# Altium schematic sheet Server_CPU_Sub_Power_Supplies.SchDoc
size D
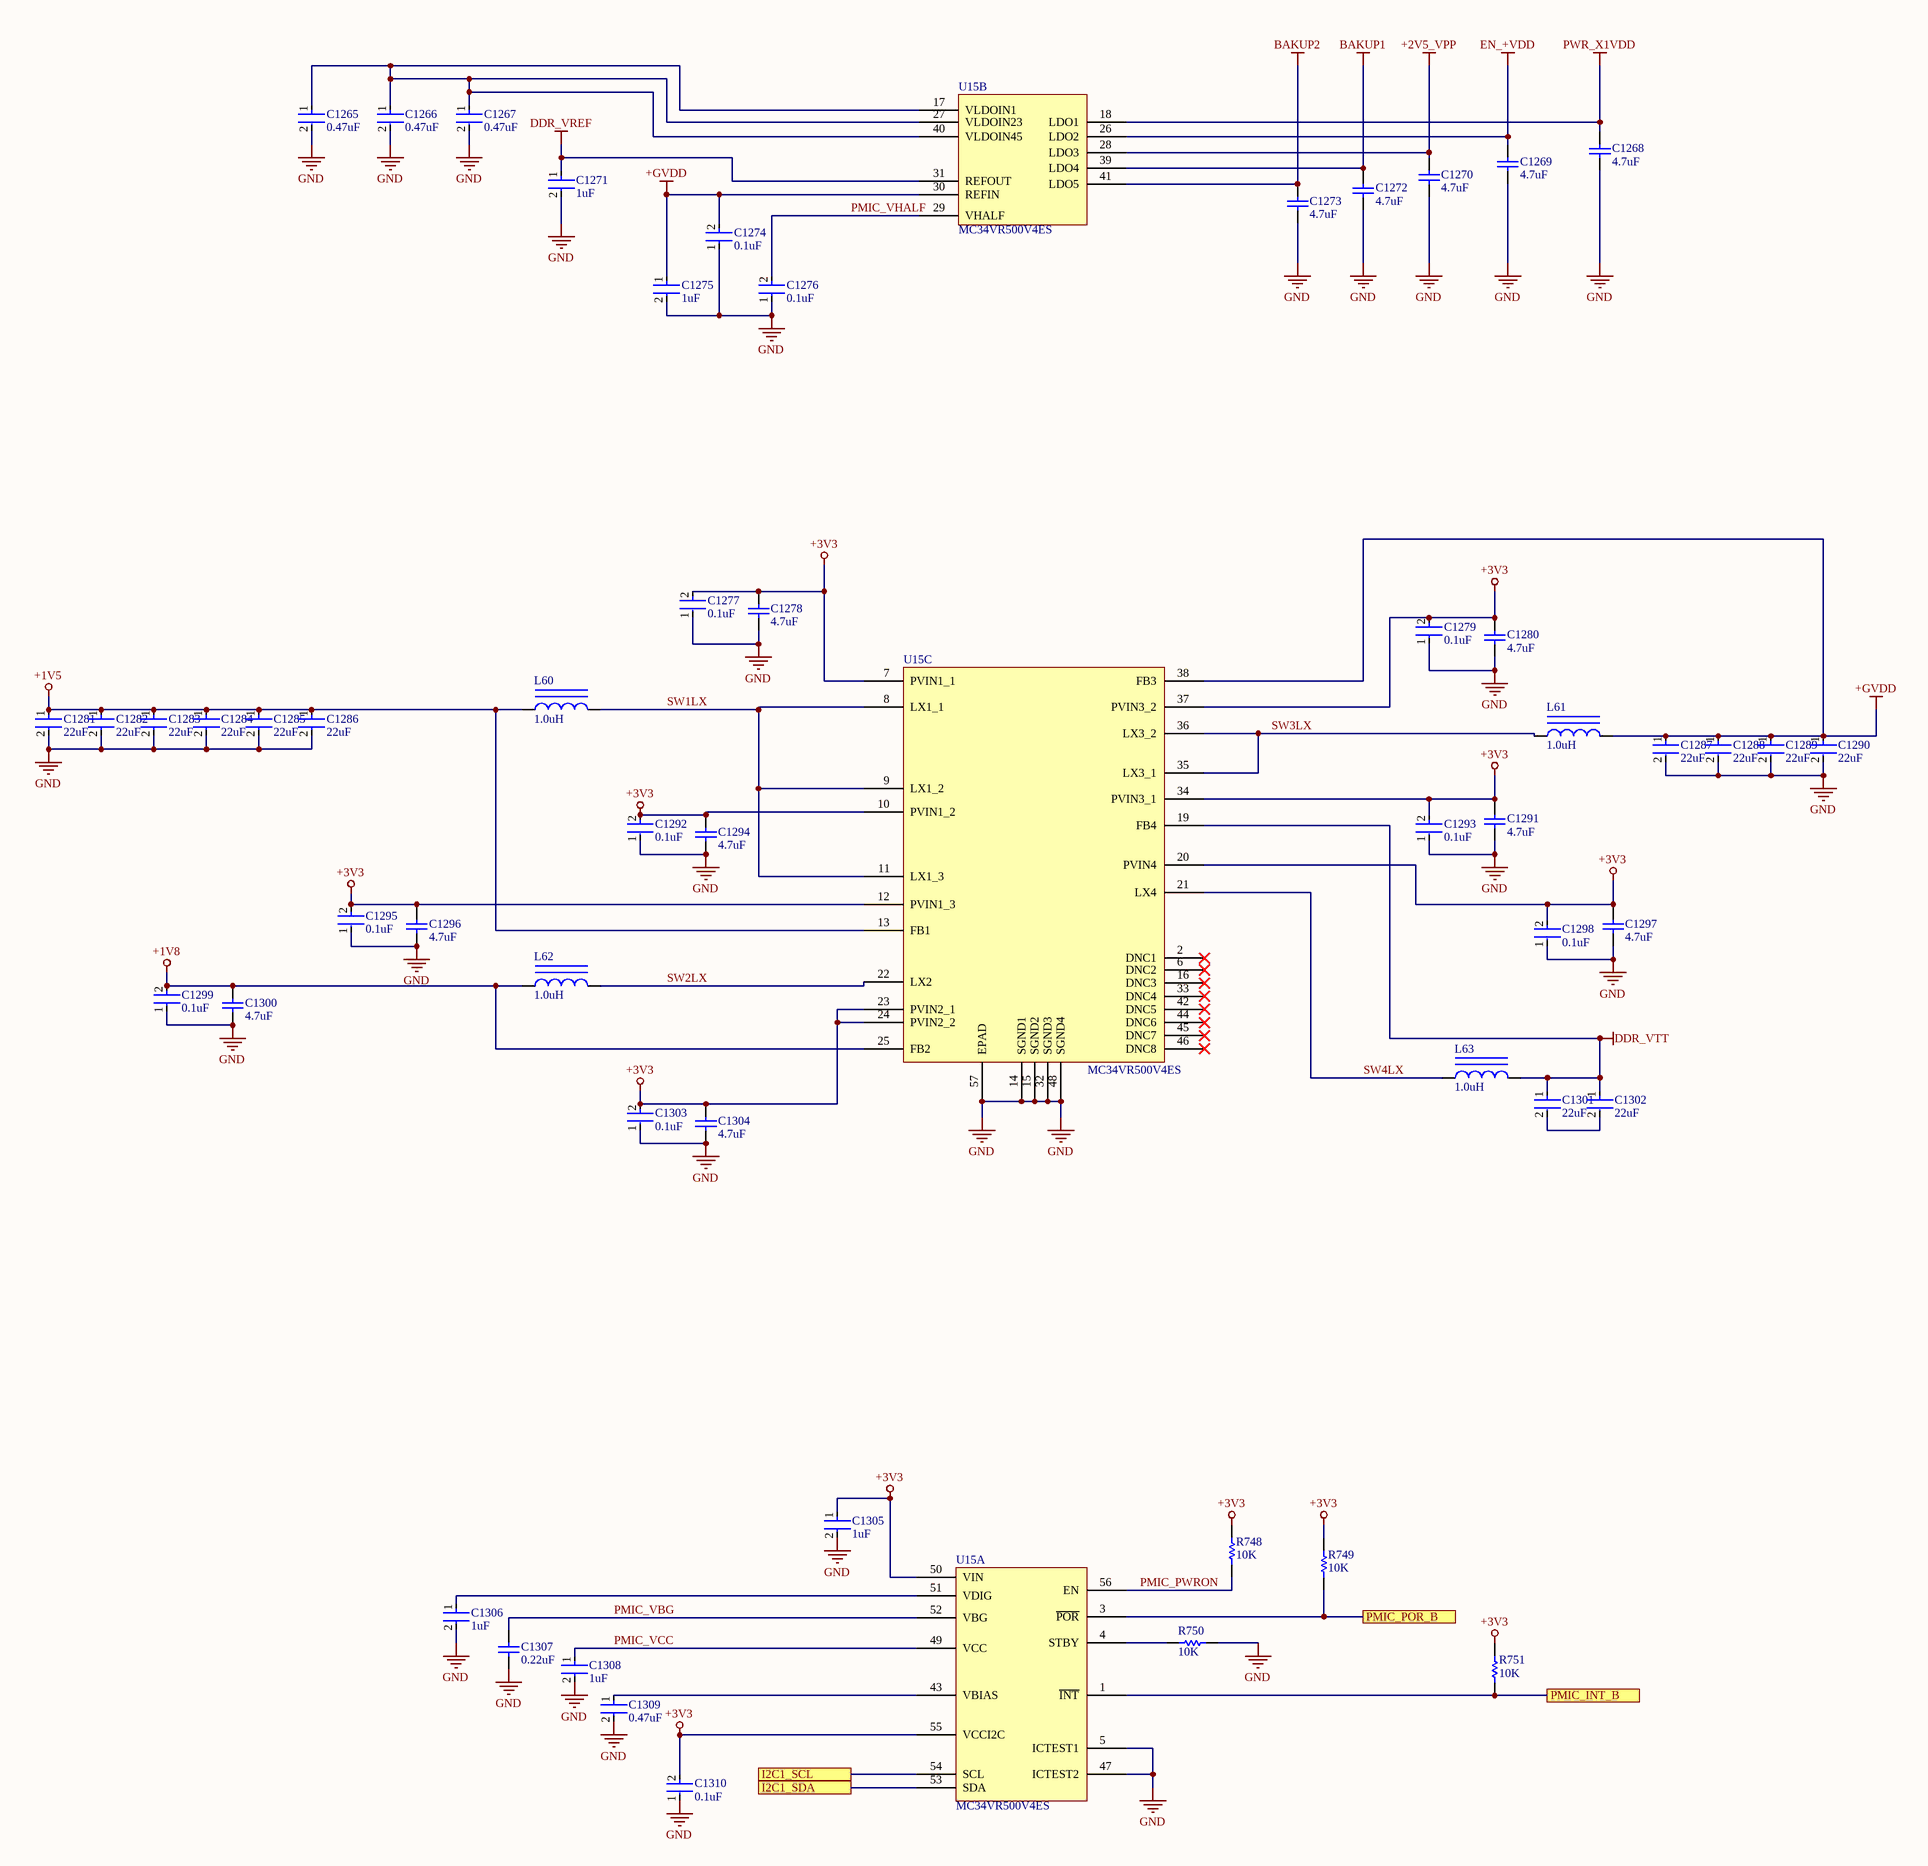
[diagram p0: Server_CPU_Sub_Power_Supplies.SchDoc]

## Parts
C1265  0.47uF  [FP-GRM188-0_1-e0_2_0_5-IPC_B]
C1266  0.47uF  [FP-GRM188-0_1-e0_2_0_5-IPC_B]
C1267  0.47uF  [FP-GRM188-0_1-e0_2_0_5-IPC_B]
C1268  4.7uF  [CAPC2013X145X50ML20T25]
C1269  4.7uF  [CAPC2013X145X50ML20T25]
C1270  4.7uF  [CAPC2013X145X50ML20T25]
C1271  1uF  [FP-GRM15-0_1-MFG]
C1272  4.7uF  [CAPC2013X145X50ML20T25]
C1273  4.7uF  [CAPC2013X145X50ML20T25]
C1274  0.1uF  [FP-GRM15-MFG]
C1275  1uF  [FP-GRM15-0_1-MFG]
C1276  0.1uF  [FP-GRM15-MFG]
C1277  0.1uF  [FP-GRM15-MFG]
C1278  4.7uF  [CAPC2013X145X50ML20T25]
C1279  0.1uF  [FP-GRM15-MFG]
C1280  4.7uF  [CAPC2013X145X50ML20T25]
C1281  22uF  [FP-GRM21B-0_15-MFG]
C1282  22uF  [FP-GRM21B-0_15-MFG]
C1283  22uF  [FP-GRM21B-0_15-MFG]
C1284  22uF  [FP-GRM21B-0_15-MFG]
C1285  22uF  [FP-GRM21B-0_15-MFG]
C1286  22uF  [FP-GRM21B-0_15-MFG]
C1287  22uF  [FP-GRM21B-0_15-MFG]
C1288  22uF  [FP-GRM21B-0_15-MFG]
C1289  22uF  [FP-GRM21B-0_15-MFG]
C1290  22uF  [FP-GRM21B-0_15-MFG]
C1291  4.7uF  [CAPC2013X145X50ML20T25]
C1292  0.1uF  [FP-GRM15-MFG]
C1293  0.1uF  [FP-GRM15-MFG]
C1294  4.7uF  [CAPC2013X145X50ML20T25]
C1295  0.1uF  [FP-GRM15-MFG]
C1296  4.7uF  [CAPC2013X145X50ML20T25]
C1297  4.7uF  [CAPC2013X145X50ML20T25]
C1298  0.1uF  [FP-GRM15-MFG]
C1299  0.1uF  [FP-GRM15-MFG]
C1300  4.7uF  [CAPC2013X145X50ML20T25]
C1301  22uF  [FP-GRM21B-0_15-MFG]
C1302  22uF  [FP-GRM21B-0_15-MFG]
C1303  0.1uF  [FP-GRM15-MFG]
C1304  4.7uF  [CAPC2013X145X50ML20T25]
C1305  1uF  [FP-GRM15-0_1-MFG]
C1306  1uF  [FP-GRM15-0_1-MFG]
C1307  0.22uF  [CAPC1005X55X25NL05T10]
C1308  1uF  [FP-GRM15-0_1-MFG]
C1309  0.47uF  [FP-GRM188-0_1-e0_2_0_5-IPC_B]
C1310  0.1uF  [FP-GRM15-MFG]
L60  1.0uH  [BOUR-CM45_L]
L61  1.0uH  [BOUR-CM45_L]
L62  1.0uH  [BOUR-CM45_L]
L63  1.0uH  [BOUR-CM45_L]
R748  10K  [RESC1005X40X25LL05T05]
R749  10K  [RESC1005X40X25LL05T05]
R750  10K  [RESC1005X40X25LL05T05]
R751  10K  [RESC1005X40X25LL05T05]
U15  MC34VR500V4ES  [QFN50P800X800X90-57N]  (parts A,B,C of 3)

## Ports
I2C1_SCL, I2C1_SDA, PMIC_INT_B, PMIC_POR_B

## Nets
+1V5: C1281.1 C1282.1 C1283.1 C1284.1 C1285.1 C1286.1 L60.1 U15.13(FB1)
+1V8: C1299.2 C1300.2 L62.1 U15.25(FB2)
+2V5_VPP: C1270.2 U15.28(LDO3)
+3V3: C1277.2 C1278.2 C1279.2 C1280.2 C1291.2 C1292.2 C1293.2 C1294.2 C1295.2 C1296.2 C1297.2 C1298.2 C1303.2 C1304.2 C1305.1 C1310.2 R748.2 R749.2 R751.2 U15.7(PVIN1_1) U15.10(PVIN1_2) U15.12(PVIN1_3) U15.20(PVIN4) U15.23(PVIN2_1) U15.24(PVIN2_2) U15.34(PVIN3_1) U15.37(PVIN3_2) U15.50(VIN) U15.55(VCCI2C)
+GVDD: C1274.2 C1275.1 C1287.1 C1288.1 C1289.1 C1290.1 L61.2 U15.30(REFIN) U15.38(FB3)
BAKUP1: C1272.2 U15.39(LDO4)
BAKUP2: C1273.2 U15.41(LDO5)
DDR_VREF: C1271.1 U15.31(REFOUT)
DDR_VTT: C1301.1 C1302.1 L63.2 U15.19(FB4)
EN_+VDD: C1269.2 U15.26(LDO2)
GND: C1265.2 C1266.2 C1267.2 C1268.1 C1269.1 C1270.1 C1271.2 C1272.1 C1273.1 C1274.1 C1275.2 C1276.1 C1277.1 C1278.1 C1279.1 C1280.1 C1281.2 C1282.2 C1283.2 C1284.2 C1285.2 C1286.2 C1287.2 C1288.2 C1289.2 C1290.2 C1291.1 C1292.1 C1293.1 C1294.1 C1295.1 C1296.1 C1297.1 C1298.1 C1299.1 C1300.1 C1303.1 C1304.1 C1305.2 C1306.2 C1307.1 C1308.2 C1309.2 C1310.1 R750.1 U15.5(ICTEST1) U15.14(SGND1) U15.15(SGND2) U15.32(SGND3) U15.47(ICTEST2) U15.48(SGND4) U15.57(EPAD)
PWR_X1VDD: C1268.2 U15.18(LDO1)
I2C1_SCL: U15.54(SCL) ; port I2C1_SCL
I2C1_SDA: U15.53(SDA) ; port I2C1_SDA
PMIC_INT_B: R751.1 U15.1(~{INT}) ; port PMIC_INT_B
PMIC_POR_B: R749.1 U15.3(~{POR}) ; port PMIC_POR_B
PMIC_PWRON: R748.1 U15.56(EN)
PMIC_VBG: C1307.2 U15.52(VBG)
PMIC_VCC: C1308.1 U15.49(VCC)
PMIC_VHALF: C1276.2 U15.29(VHALF)
SW1LX: L60.2 U15.8(LX1_1) U15.9(LX1_2) U15.11(LX1_3)
SW2LX: L62.2 U15.22(LX2)
SW3LX: L61.1 U15.35(LX3_1) U15.36(LX3_2)
SW4LX: L63.1 U15.21(LX4)
NetC1265_1: C1265.1 C1266.1 C1267.1 U15.17(VLDOIN1) U15.27(VLDOIN23) U15.40(VLDOIN45)
NetC1301_2: C1301.2 C1302.2
NetC1306_1: C1306.1 U15.51(VDIG)
NetC1309_1: C1309.1 U15.43(VBIAS)
NetR750_2: R750.2 U15.4(STBY)

Not connected (* = marked no-connect by the designer): U15 2(DNC1)* 6(DNC2)* 16(DNC3)* 33(DNC4)* 42(DNC5)* 44(DNC6)* 45(DNC7)* 46(DNC8)*

## Notes on the sheet
- Title
- Size:
- Date:
- File:
- D
- Number:
- Time:
- Revision:
- Sheet
- of

## Library data of the parts
C1265-C1267 C1309 = CMP-2006-02860-2: Chip Multilayer Ceramic Capacitors for General Purpose, 0603, 0.47uF, X7R, 15%, 10%, 16V; Capacitance: 470nF; Material: Ceramic; Termination: SMD/SMT; Case Code (Imperial): 0603; Height: 0.8mm; Dielectric: X7R; Length: 1.6mm; Packaging: Tape and Reel; Mount: Surface Mount; Thickness: 0.035inch; Voltage Rating (DC): 16V; Case Code (Metric): 1608; REACH SVHC: No SVHC; Depth: 0.8mm; Number of Pins: 2; Max Operating Temperature: 125°C; Min Operating Temperature: -55°C; Width: 0.8mm; Voltage: 16V; Lead Free: Lead Free; Voltage Rating: 16V; Package Quantity: 1; Case/Package: 0603; Tolerance: 10%
C1268-C1270 C1272 C1273 C1278 C1280 C1291 C1294 C1296 C1297 C1300 C1304 = CMP-2007-01010-1: Manufacturer: Kemet; Part Number: C0805C475K3PACTU
C1271 C1275 C1305 C1306 C1308 = CMP-2008-04556-2: CAP CER 1UF 10V X5R 0402; Manufacturer Part Number: GRM155R61A105KE15D; Manufacturer: Murata; Material: Ceramic; Tolerance: 10%; Temperature Coefficient: 15%; Octopart: https://octopart.com/grm155r61a105ke15d-murata-197442; Lead Free: Yes; ComponentLink2Description: Datasheet; Temperature: -55°C to +85°C; Temperature Range High: +85°C; Height: 0.55mm; Capacitance: 1uF; Ipc Land Pattern Name: CAPC10050X50; ComponentLink2URL: https://search.murata.co.jp/Ceramy/image/img/A01X/G101/ENG/GRM155R61A105KE15-01A.pdf; Temperature Range Low: -55°C; Device Class L2: Capacitors; Voltage Rating: 10V; RoHS: TRUE; Device Class L1: Passive Components; Device Class L3: Ceramic Capacitors; Temperature Characteristic: X5R; Mouser Description: 0402 1 uF 10 V ±10% Tolerance X5R Surface Mount Multilayer Ceramic Capacitor; Automotive: No; Package: GRM15-0.1; Digikey Description: CAP CER 1UF 10V X5R 0402; Value: 1uF; Category: Cap
C1274 C1276 C1277 C1279 C1292 C1293 C1295 C1298 C1299 C1303 C1310 = CMP-2100-03641-2: CAP CER 0.1UF 16V X7R 0402; Manufacturer Part Number: GRM155R71C104KA88D; Manufacturer: Murata; Standoff Height: 0mm; Tolerance: 10%; Voltage Rating: 16Vdc; Material: Ceramic; Capacitance: 0.10μF; Value: 0.10μF; RoHS: TRUE; Temperature Characteristic: X7R; Octopart: https://octopart.com/grm155r71c104ka88d-murata-196880; Digikey Description: CAP CER 0.1UF 16V X7R 0402; Device Class L3: Ceramic Capacitors; Height: 0.55mm; ComponentLink2Description: Datasheet; Temperature Range Low: -55°C; Ipc Land Pattern Name: CAPC10050X219; ComponentLink2URL: https://search.murata.co.jp/Ceramy/image/img/A01X/G101/ENG/GRM155R71H471KA01-01A.pdf; Device Class L1: Passive Components; Lead Free: yes; Category: Cap; Package: GRM15; Temperature: -55°C to +125°C; Device Class L2: Capacitors; Temperature Range High: +125°C; Mouser Description: 0402 0.1 uF 16V ±10 % Tolerance X7R SMT Multilayer Ceramic Capacitor
C1281-C1290 C1301 C1302 = CMP-2007-03385-2: Chip Multilayer Ceramic Capacitors for General Purpose, 0805, 22uF, X5R, 15%, 20%, 6.3V; Material: Ceramic; Max Operating Temperature: 85°C; Voltage: 6.3V; Min Operating Temperature: -55°C; Case/Package: 0805; Thickness: 0.053inch; Dielectric: X5R; Packaging: Tape and Reel; Depth: 1.25mm; Termination: SMD/SMT; Voltage Rating (DC): 6.3V; Radiation Hardening: No; Tolerance: 20%; Mount: Surface Mount; Lead Free: Lead Free; Package Quantity: 1; REACH SVHC: No SVHC; Voltage Rating: 6.3V; Capacitance: 22uF; Length: 2mm; Case Code (Imperial): 0805; Case Code (Metric): 2012; Width: 0.049inch; Height: 1.25mm
C1307 = CMP-2008-04561-4: Chip Capacitor, 220 nF, +/- 10%, 10 V, -55 to 85 degC, 0402 (1005 Metric), RoHS, Tape and Reel; Manufacturer: Basic Passives; PartNumber: GRM155R61A224KE19D; Case\/Package: 0402; Voltage Rating: 10 V; Type (Capacitors): X5R; Capacitance: 220 nF; Max Operating Temperature: 85 degC; Package Quantity: 1; RoHSCompliant: true; Height: 0.5 mm; Mounting Technology: Surface Mount; Case Code (Metric): 1005; ComponentLink2URL: http://search.murata.co.jp/Ceramy/image/img/A01X/G101/ENG/GRM155R61A224KE19-01.pdf; Case Code (Imperial): 0402; Length: 1 mm; Radiation Hardening: No; Tolerance: 10%; Pins: 2; ComponentLink1Description: Manufacturer URL; Voltage Rating (DC): 10 V; Width: 0.5 mm; REACH SVHC: No SVHC; ComponentLink1URL: http://www.murata.com/; Min Operating Temperature: -55 degC; DatasheetVersion: 03/2016; Mount: Surface Mount; PackageReference: 0402; Packaging: Tape and Reel; ComponentLink2Description: Datasheet; PackageDescription: 2-Pin Surface Mount Device, Body 1 x 0.5 mm
L60-L63 = CMP-2000-06114-1: Chip Inductor, 1 uH, +/- 10%, 450 mA, -40 to 125 degC, 2-Pin SMD (1812), RoHS, Tape and Reel; Manufacturer: Bourns; Nominal inductivity: 1µH; Content: 1pc(s); Nominal current: 0.45A; Type: CM453232-1R0KL; Category: Inductor; Package Description: 2-Pin Surface Mount Device, Body 4.5 x 3.2 mm; Manufacturer URL: http://www.bourns.com/; LN: 1µH; Package Reference: CM45; Mounting Technology: SurfaceMount; Datasheet URL: http://www.bourns.com/docs/Product-Datasheets/cm.pdf; Datasheet Version: 03/2016
R748-R751 = CMP-2000-07588-1: Chip Resistor, 10 KOhm, +/- 1%, 0.1 W, -55 to 155 degC, 0402 (1005 Metric), RoHS, Tape and Reel; Manufacturer: Panasonic; Power Rating: 100mW; Voltage Rating: 50V; Resistance: 10KOhm; Case\/Package: 0402; Temperature Coefficient: 100ppm\/degreesC; RoHSCompliant: True; Lead Free: LeadFree; Package Quantity: 1; Contact Plating: Tin; Length: 1mm; Radiation Hardening: No; REACH SVHC: NoSVHC; Max Operating Temperature: 155degC; Depth: 0.5mm; Case Code (Imperial): 0402; Military Standard: Not; Package Description: 2-Pin Surface Mount Device, Body 1 x 0.5 mm; Termination: SMD/SMT; Case Code (Metric): 1005; Height: 0.35mm; Packaging: TapeandReel; Voltage Rating (DC): 50V; Package Reference: 402; Number of Pins: 2; Tolerance: 1%; Mounting Technology: SurfaceMount; Width: 0.02inch; Mount: SurfaceMount; Datasheet URL: https://industrial.panasonic.com/cdbs/www-data/pdf/RDA0000/AOA0000C304.pdf; Composition: ThickFilm; Datasheet Version: 02/2017; Manufacturer URL: http://www.panasonic.com/; Max Power Dissipation: 100mW; Number of Terminations: 2; Min Operating Temperature: -55degC
U15 = MC34VR500V4ES: Regulator, Buck, Quad with up to 4.5A Output and Triple User-programmable LDOs, QFN 56, Tray; MF: {'manufacturer': u'NXP Semiconductors'}; Package: None; MP: MC34VR500V4ES; Value: *; Availability: Unavailable; Price: None